# EasyEDA Pro project ESP32_Wroom.eprj, board PCB4
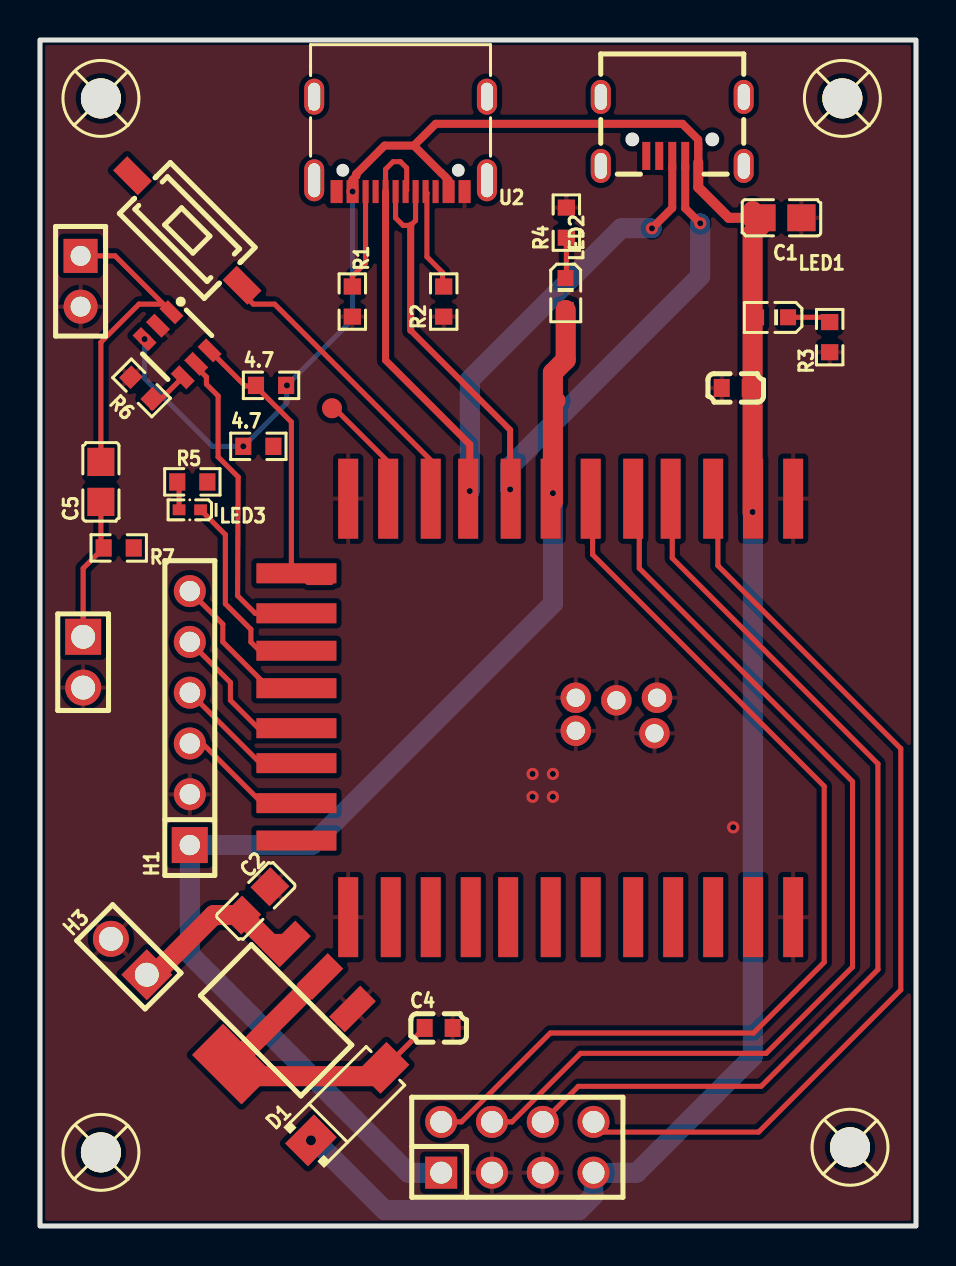
[diagram p7: board, top side]
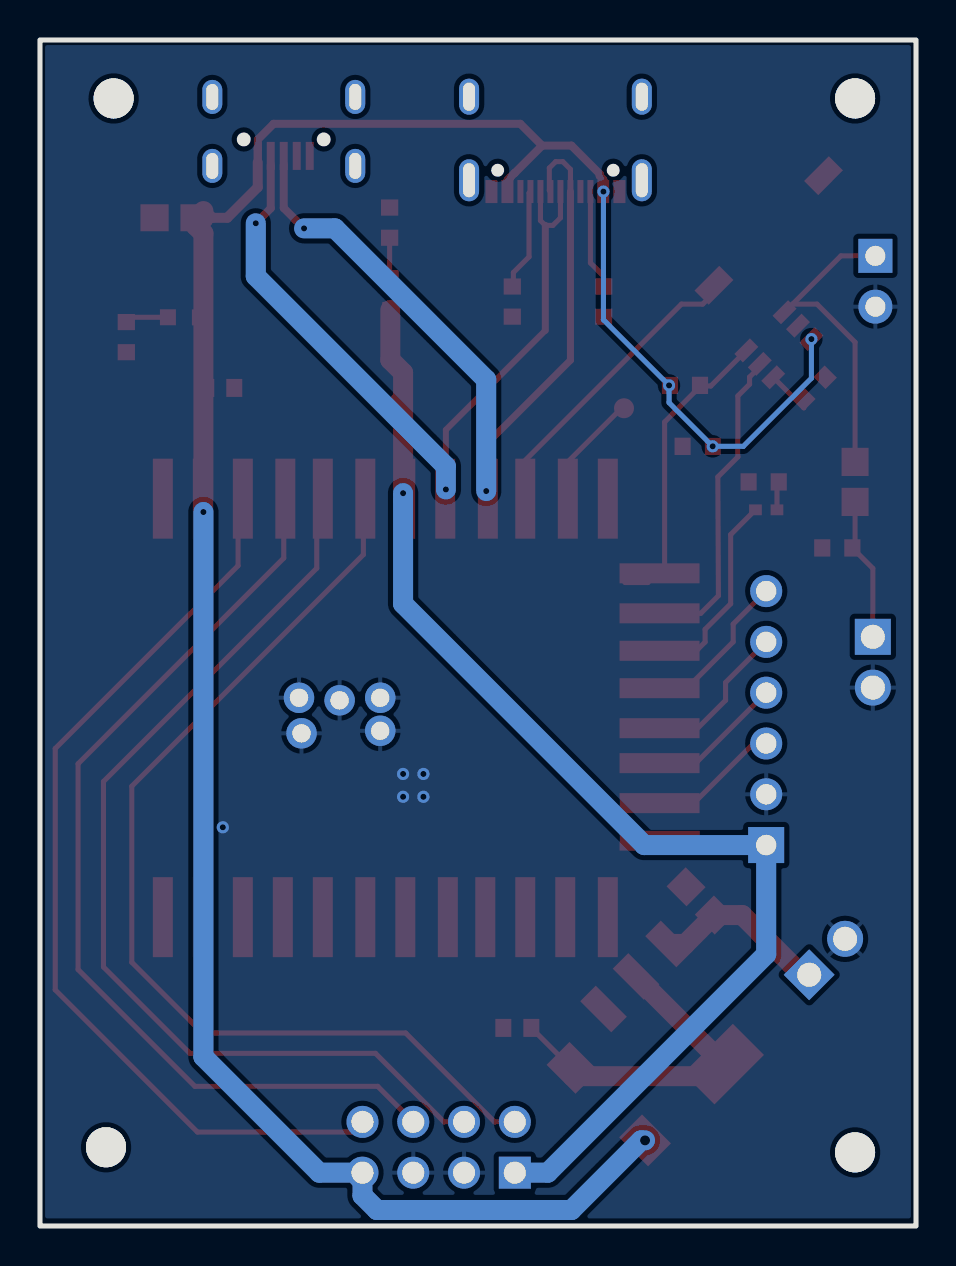
[diagram p8: board, bottom side, seen from below]

Outline 43.82 x 59.31 mm; copper layers: Top Layer, Bottom Layer. Coordinates in mm from the lower left corner of the outline.
Outline path: rectangle 0,59.31 43.82,0
Stack: Top Layer 0.035mm / Dielectric1 1.51mm FR4 er 4.5 / Bottom Layer 0.035mm

## Design rules (mm)
template: JLCPCB Capability(Two Layers Board)
spacing copperThickness1oz (default): track to track 0.102, other pairs 0.152 to 0.3
spacing copperThickness2oz: track to track 0.203, other pairs 0.152 to 0.3
track width copperThickness1oz (default): min 0.127, default 0.254, max 2.54
track width copperThickness2oz: min 0.203, default 0.254, max 2.54
differential pair differentialPair (default): width min 0.127, default 0.254, max 2.54; gap min 0.152, default 0.152
via viaSize (default): diameter min 0.5, default 0.61, max 10; hole min 0.3, default 0.305, max 6.3

## Placement (name value [footprint] x y rotation side)
4.7  -  [R0603]  10.92 38.99 0 top
4.7#2  -  [R0603]  11.56 42.04 0 top
C1  100nF  [C0805]  37.08 50.42 0 top
C2  100nF  [C0805]  10.8 16.26 45 top
C3  100nF  [C0603]  34.8 41.91 0 top
C4  100nF  [C0603]  19.94 9.91 0 top
C5  100nF  [C0805]  3.05 37.21 90 top
D1  -  [SMA_L4.4-W2.8-LS5.4-RD]  15.37 6.1 45 top
H1  -  [HDR-TH_6P-P2.54-V-F]  7.49 25.4 90 top
H2  -  [HDR-TH_8P-P2.54-V-F-R2-C4-S2.54-1]  23.88 3.94 0 top
H3  -  [HDR-TH_2P-P2.54-V-M-2]  4.45 13.46 45 top
H4  -  [HDR-TH_2P-P2.54-V-F]  2.03 47.24 270 top
H5  -  [HDR-TH_2P-P2.54-V-M-2]  2.16 28.19 180 top
LED1  -  [LED0603-RD_GREEN]  36.62 45.44 180 top
LED2  -  [LED0603-RD_GREEN]  26.29 46.61 270 top
LED3  -  [LED0402-RD_YELLOW]  7.49 35.81 180 top
MARK1  -  [Mark-Point-1mm]  14.61 40.89 0 top
MARK2  -  [Mark-Point-1mm]  25.78 41.27 0 top
NOREF  -  [Pad_e299]  26.8 24.76 0 top
NOREF#2  -  [Pad_e297]  30.86 26.42 0 top
NOREF#3  -  [Pad_e300]  28.83 26.29 0 top
NOREF#4  -  [Pad_e296]  26.8 26.42 0 top
NOREF#5  -  [Pad_e298]  30.73 24.64 0 top
R1  10K  [R0603]  15.62 46.23 270 top
R2  10K  [R0603]  20.19 46.23 90 top
R3  10K  [R0603]  39.5 44.45 270 top
R4  10K  [R0603]  26.33 50.18 90 top
R5  10K  [R0603]  7.62 37.21 0 top
R6  10K  [R0603]  5.08 41.91 315 top
R7  10K  [R0603]  3.94 33.91 180 top
SCREW1  -  [Screw-Hole-M2]  3.05 56.39 0 top
SCREW2  -  [Screw-Hole-M2]  40.13 56.39 0 top
SCREW3  -  [Screw-Hole-M2]  40.51 3.94 0 top
SCREW4  -  [Screw-Hole-M2]  3.05 3.68 0 top
SW?  HX-3x6x2.5-X SMD tact Switch  [SW-SMD_HX-3X6X2.5-X]  7.37 49.78 135 top
U2  TYPE C-ZL-106PWB  [TYPE-C-SMD_HDGC_TYPE-C-ZL-106PWB]  18.03 54.1 180 top
U4  -  [SOT-223_L6.7-W3.5-P2.30-BR]  11.81 10.29 45 top
U?  -  [SOT-23-6_L2.9-W1.6-P0.95-LS2.8-BR]  6.86 44.07 135 top
U?#2  -  [WIORP2040]  16.38 15.62 270 top
USB1  -  [MINI-USB-SMD_MICRO-4P-DIP]  31.62 54.74 180 top

## Footprints (pads in the part's own frame, mm; a bottom-side part is the same pattern mirrored in y, then rotated)
C0603
  rect 0.8x0.9 smd: 1(-0.7,0) 2(0.7,0)
C0805
  rect 1.41x1.35 smd: 1(-1,0) 2(1,0)
HDR-TH_2P-P2.54-V-F
  rect 1.7x1.7 hole 1: 1(-1.27,0)
  round 1.7 hole 1: 2(1.27,0)
HDR-TH_2P-P2.54-V-M-2
  rect 1.8x1.8 hole 1.2: 1(0,-1.27)
  round 1.8 hole 1.2: 2(0,1.27)
HDR-TH_6P-P2.54-V-F
  rect 1.8x1.8 hole 1.02: 1(-6.35,0)
  round 1.6 hole 1.02: 2(-3.81,0) 3(-1.27,0) 4(1.27,0) 5(3.81,0) 6(6.35,0)
HDR-TH_8P-P2.54-V-F-R2-C4-S2.54-1
  rect 1.6x1.6 hole 1.1: 1(-3.81,-1.27)
  round 1.6 hole 1.1: 2(-3.81,1.27) 3(-1.27,-1.27) 4(-1.27,1.27) 5(1.27,-1.27) 6(1.27,1.27) 7(3.81,-1.27) 8(3.81,1.27)
LED0402-RD_YELLOW
  rect 0.636x0.54 smd: 1(-0.538,0) 2(0.538,0)
LED0603-RD_GREEN
  rect 0.8x0.8 smd: 1(-0.799,-0.004) 2(0.799,0.004)
Mark-Point-1mm
  round 1 smd: 1(0,0)
MINI-USB-SMD_MICRO-4P-DIP
  rect 0.4x1.4 smd: 1(-1.3,1.225) 2(-0.65,1.225) 3(0,1.225) 4(0.65,1.225) 5(1.3,1.225)
  oval 1x1.7 hole 0.6x1.3: 6(-3.575,1.725) 6(-3.575,-1.725) 6(3.575,1.725) 6(3.575,-1.725)
Pad_e296
  round 1.524 hole 0.914: 1(0,0)
Pad_e297
  round 1.524 hole 0.914: 2(0,0)
Pad_e298
  round 1.524 hole 0.914: 3(0,0)
Pad_e299
  round 1.524 hole 0.914: 4(0,0)
Pad_e300
  round 1.524 hole 0.914: 5(0,0)
R0603
  rect 0.806x0.864 smd: 1(-0.753,0) 2(0.753,0)
Screw-Hole-M2
  round 2 hole 2: 1(0,0)
SMA_L4.4-W2.8-LS5.4-RD
  rect 2.046x1.62 smd: 1(-2.565,0) 2(2.565,0)
SOT-23-6_L2.9-W1.6-P0.95-LS2.8-BR
  rect 1.1x0.6 smd: 1(1.35,-0.95) 2(1.35,0) 3(1.35,0.95) 4(-1.35,0.95) 5(-1.35,0) 6(-1.35,-0.95)
SOT-223_L6.7-W3.5-P2.30-BR
  rect 2.2x1.1 smd: 1(3.099,-2.3) 2(3.099,0) 3(3.099,2.3)
  rect 2.2x3.5 smd: 4(-3.099,0)
SW-SMD_HX-3X6X2.5-X
  rect 1.75x1 smd: 1(-3.875,0) 2(3.875,0)
TYPE-C-SMD_HDGC_TYPE-C-ZL-106PWB
  oval 1x2.1 hole 0.6x1.7: 12(-4.32,1.808) 13(4.32,1.808)
  oval 1x1.8 hole 0.6x1.4: 14(-4.32,-2.373) 15(4.32,-2.373)
  rect 0.6x1.15 smd: A1B12(-3.2,2.373) A4B9(-2.4,2.373) A9B4(2.4,2.373) A12B1(3.2,2.373)
  rect 0.3x1.15 smd: A5(-1.25,2.373) A6(-0.25,2.373) A7(0.25,2.373) A8(1.25,2.373) B5(1.75,2.373) B6(0.75,2.373) B7(-0.75,2.373) B8(-1.75,2.373)
WIORP2040
  rect 4x1 smd: 1(-20.75,21.287) 2(-20.75,19.287) 3(-20.75,17.287) 4(-20.75,15.16) 5(-20.75,13.287) 6(-20.75,11.16) 7(-20.75,9.16) 8(-20.75,7.16) 9(-20.75,5.033) 10(-20.75,3.16) 11(-20.75,1.033) 12(-20.75,-0.967) 21(0.176,-0.967) 22(0.176,1.16) 23(0.176,3.16) 24(0.176,5.16) 25(0.176,7.033) 26(0.176,9.16) 27(0.176,11.16) 28(0.176,13.287) 29(0.176,15.287) 30(0.176,17.287) 31(0.176,19.287) 32(0.176,21.287)
  rect 1x4 smd: 13(-17.018,-3.556) 14(-15.018,-3.556) 15(-13.145,-3.556) 16(-11.272,-3.556) 17(-9.272,-3.556) 18(-7.526,-3.556) 19(-5.526,-3.556) 20(-3.653,-3.556)

## Nets
3.3V: H1.1 H2.1 LED2.2 MARK2.1 U?#2.7
5V: C4.1 D1.2 U4.2 U4.4
GND: C1.2 C2.2 C3.1 C4.2 H1.2 H2.3 H2.5 H3.2 H4.2 H5.2 NOREF.4 NOREF#2.2 NOREF#3.5 NOREF#4.1 NOREF#5.3 R1.2 R2.1 R3.2 R4.2 R6.1 U2.A1B12 U4.1 U?.2 U?#2.1 U?#2.12 U?#2.21 U?#2.32
VCC: 4.7.1 4.7#2.2 C1.1 C3.2 D1.1 H2.7 LED1.2 U2.A4B9 U2.A9B4 U?.3 U?#2.2 USB1.1
0: 4.7#2.1 U?.6 U?#2.13
1: U?.5 U?#2.14
4: H1.6 U?#2.16
5: H1.5 U?#2.17
6: H1.4 U?#2.18
7: H1.3 U?#2.19
16: LED3.1 U?#2.15
ACC: R7.1
ADC0: H2.2 U?#2.6
ADC1: H2.4 U?#2.5
ADC2: H2.6 U?#2.4
ADC3: H2.8 U?#2.3
BOOT: SW?.1 U?#2.10
CEK: LED3.2 R5.1
DN: U2.A7 U2.B7 U?#2.8 USB1.2
DP: U2.A6 U2.B6 U?#2.9 USB1.3
FIL: C5.1 H5.1 R7.2
IN: C2.1 H3.1 U4.3
OUT: C5.2 H4.1 U?.1
RUN: MARK1.1 U?#2.11
$1N13230: U2.A12B1
$1N13312: R2.2 U2.A5
$1N13321: R1.1 U2.B5
$1N13864: LED1.1 R3.1
$1N13986: LED2.1 R4.1

Pads without a net: 4.7 2; R5 2; R6 2; SCREW1 1; SCREW2 1; SCREW3 1; SCREW4 1; SW? 2; U2 12 13 14 15 A8 B8; U? 4; U?#2 20 22 23 24 25 26 27 28 29 30 31; USB1 4 5 6

## Via types
v1: diameter 0.61, hole 0.305, Top Layer to Bottom Layer, 15 vias
v2: diameter 0.9, hole 0.5, Top Layer to Bottom Layer, 1 via

## Routing (per net, layer and track width the routed paths; a pad name or vN(x,y) marks a point on that pad's centre or on a via; arc(x,y) is an arc through that point)
3.3V: length 61.1
  Top Layer w1: LED2.2 26.29,43.31 25.65,42.67 v1(25.65,36.65) 25.65,36.22 25.64,36.21
  Bottom Layer w1: v1(25.65,36.65) 25.65,31.11 13.59,19.05 7.49,19.05 7.49,13.59 18.42,2.67 H2.1
5V: length 17.3
  Top Layer w0.254: 17.18,7.91 17.24,7.91 19.24,9.91
  Top Layer w1: 14,12.48 9.62,8.1 10.22,7.49 17.18,7.49 17.18,7.91
GND:
  vias: v1(24.64,22.61) v1(24.64,21.46) v1(25.65,22.61) v1(25.65,21.46) v1(34.67,19.94)
VCC: length 121.6
  Top Layer w0.4: 18.7,54.03 17.23,54.03 15.82,52.62 15.82,52.51 15.63,52.33 v1(15.63,51.73) ; 18.7,54.03 20.07,52.66 20.08,52.66 20.29,52.45 20.29,52.44 20.43,52.3 U2.A4B9 ; 18.7,54.03 19.79,55.12 32.13,55.12 32.92,54.33 32.92,53.85 32.92,53.19
  Top Layer w0.5: 32.92,53.19 32.92,51.94 34.45,50.42 35.18,50.42 35.51,50.75 35.64,50.75 35.67,50.78
  Top Layer w1: v1(35.64,35.7) 35.64,49.64 36.01,50.01 35.64,50.38 35.64,50.75
  Bottom Layer w0.254: v1(5.23,44.35) 5.23,42.39 8.64,38.99 v1(10.17,38.99) 12.35,41.17 v1(12.35,42.04) 15.63,45.32 v1(15.63,51.73)
  Bottom Layer w1: v1(35.64,35.7) 35.64,8.46 29.84,2.67 H2.7 27.69,1.52 26.96,0.8 17.23,0.8 13.75,4.28 v2(13.55,4.28)
(no net): length 2.6
  Top Layer w0.254: 7.14,42.44 5.61,40.91 R6.2
0: length 15.5
  Top Layer w0.254: 10.77,42.01 11.06,42.29 ; 10.77,42.01 12.57,40.21 12.57,33.02 13.42,32.18 14.56,32.18 ; 10.77,42.01 10.26,42.01 8.48,43.79
1: length 15.8
  Top Layer w0.254: U?#2.14 10.76,30.64 9.88,31.52 9.91,37.46 8.91,38.46 8.91,41.51 8.32,42.09 8.32,42.45 7.81,42.97 U?.5
4: length 8.6
  Top Layer w0.254: 13.62,26.92 11.43,26.92 9.14,29.21 9.14,30.1 H1.6
5: length 8.2
  Top Layer w0.254: 13.35,24.78 11.03,24.78 9.53,26.29 9.53,27.18 7.49,29.21
6: length 8
  Top Layer w0.254: 14.07,23.24 10.92,23.24 H1.4
7: length 7.7
  Top Layer w0.254: 13.91,21.08 11.18,21.08 8.13,24.13 7.49,24.13
16: length 11
  Top Layer w0.254: 8.03,35.81 9.27,34.57 9.27,31.11 10.55,29.84 10.55,29.2 10.92,28.83 13.75,28.83
ADC0: length 50.3
  Top Layer w0.254: H2.2 21.08,5.21 25.53,9.65 35.69,9.65 39.22,13.19 39.22,21.99 27.64,33.57 27.64,36.21
ADC1: length 48.2
  Top Layer w0.254: H2.4 23.61,5.21 27.04,8.64 36.32,8.64 40.64,12.95 40.64,22.22 29.97,32.89 29.97,35.18 29.72,35.43
ADC2: length 46.8
  Top Layer w0.254: H2.6 26.92,6.98 36.07,6.98 41.91,12.83 41.91,23.11 31.62,33.4 31.62,35.43
ADC3: length 46.2
  Top Layer w0.254: H2.8 28.19,4.7 35.94,4.7 43.05,11.81 43.05,23.88 33.91,33.02 33.91,35.31 33.66,35.56
BOOT: length 15.4
  Top Layer w0.254: 19.62,36.23 19.62,38.21 11.73,46.1 10.67,46.1 10.11,46.66 10.11,47.04
CEK: length 1.4
  Top Layer w0.254: R5.1 6.96,37.12 LED3.2
DN: length 40.4
  Top Layer w0.254: 23.64,36.21 23.51,36.34 v1(23.51,36.83) ; U2.B7 18.78,50.28 18.54,50.04 18.16,50.04 17.78,50.41 U2.A7
  Top Layer w0.3: v1(23.51,36.83) 23.51,39.81 18.54,44.78
  Top Layer w0.35: 18.54,50.04 18.54,44.78
  Top Layer w0.4: 32.27,53.06 32.27,50.89 v1(33.02,50.14)
  Bottom Layer w1: v1(23.51,36.83) 23.51,37.99 33.02,47.5 v1(33.02,50.14)
DP: length 42.4
  Top Layer w0.254: U2.A6 18.34,51.79 18.34,52.91 18.02,53.22 17.66,53.22 17.28,52.84 U2.B6 ; v1(21.5,36.75) 21.5,36.36 21.62,36.23
  Top Layer w0.35: U2.B6 17.28,43.29 21.5,39.08 v1(21.5,36.75)
  Top Layer w0.4: v1(30.61,49.89) 31.62,50.91 31.62,53.06
  Bottom Layer w1: v1(21.5,36.75) 21.5,42.32 29.06,49.89 v1(30.61,49.89)
FIL: length 7.2
  Top Layer w0.254: C5.1 3.05,34.04 R7.2 2.16,32.88 H5.1
IN: length 8.9
  Top Layer w1: U4.3 11.53,14.1 C2.1 8.69,15.55 5.71,12.56 5.34,12.56
OUT: length 15.6
  Top Layer w0.254: C5.2 3.05,44.2 4.95,46.1 6.17,46.1 ; 6.17,46.1 6.58,45.7 ; 6.17,46.1 3.76,48.51 H4.1
RUN: length 6.2
  Top Layer w0.254: MARK1.1 14.61,41.02 17.62,38 17.62,36.23
$1N13312: length 5.1
  Top Layer w0.254: U2.A5 19.36,51.66 19.36,48.46 20.14,47.68 20.14,47.04 R2.2
$1N13321: length 5
  Top Layer w0.254: U2.B5 16.28,48.16 15.62,47.5 R1.1
$1N13864: length 2.2
  Top Layer w0.254: R3.1 39.26,45.44 LED1.1
$1N13986: length 2
  Top Layer w0.254: LED2.1 26.33,47.45 R4.1

## Copper pours and planes (outline as drawn; the poured copper is in the pictures)
GND on Top Layer: -0.63,63.37 49.53,63.37 49.53,0.25 -0.63,0.25
GND on Bottom Layer: -3.94,64.39 50.67,64.39 50.67,0.38 -3.94,0.38
